# EAGLE schematic ArduCuff (EAGLE 6.0)
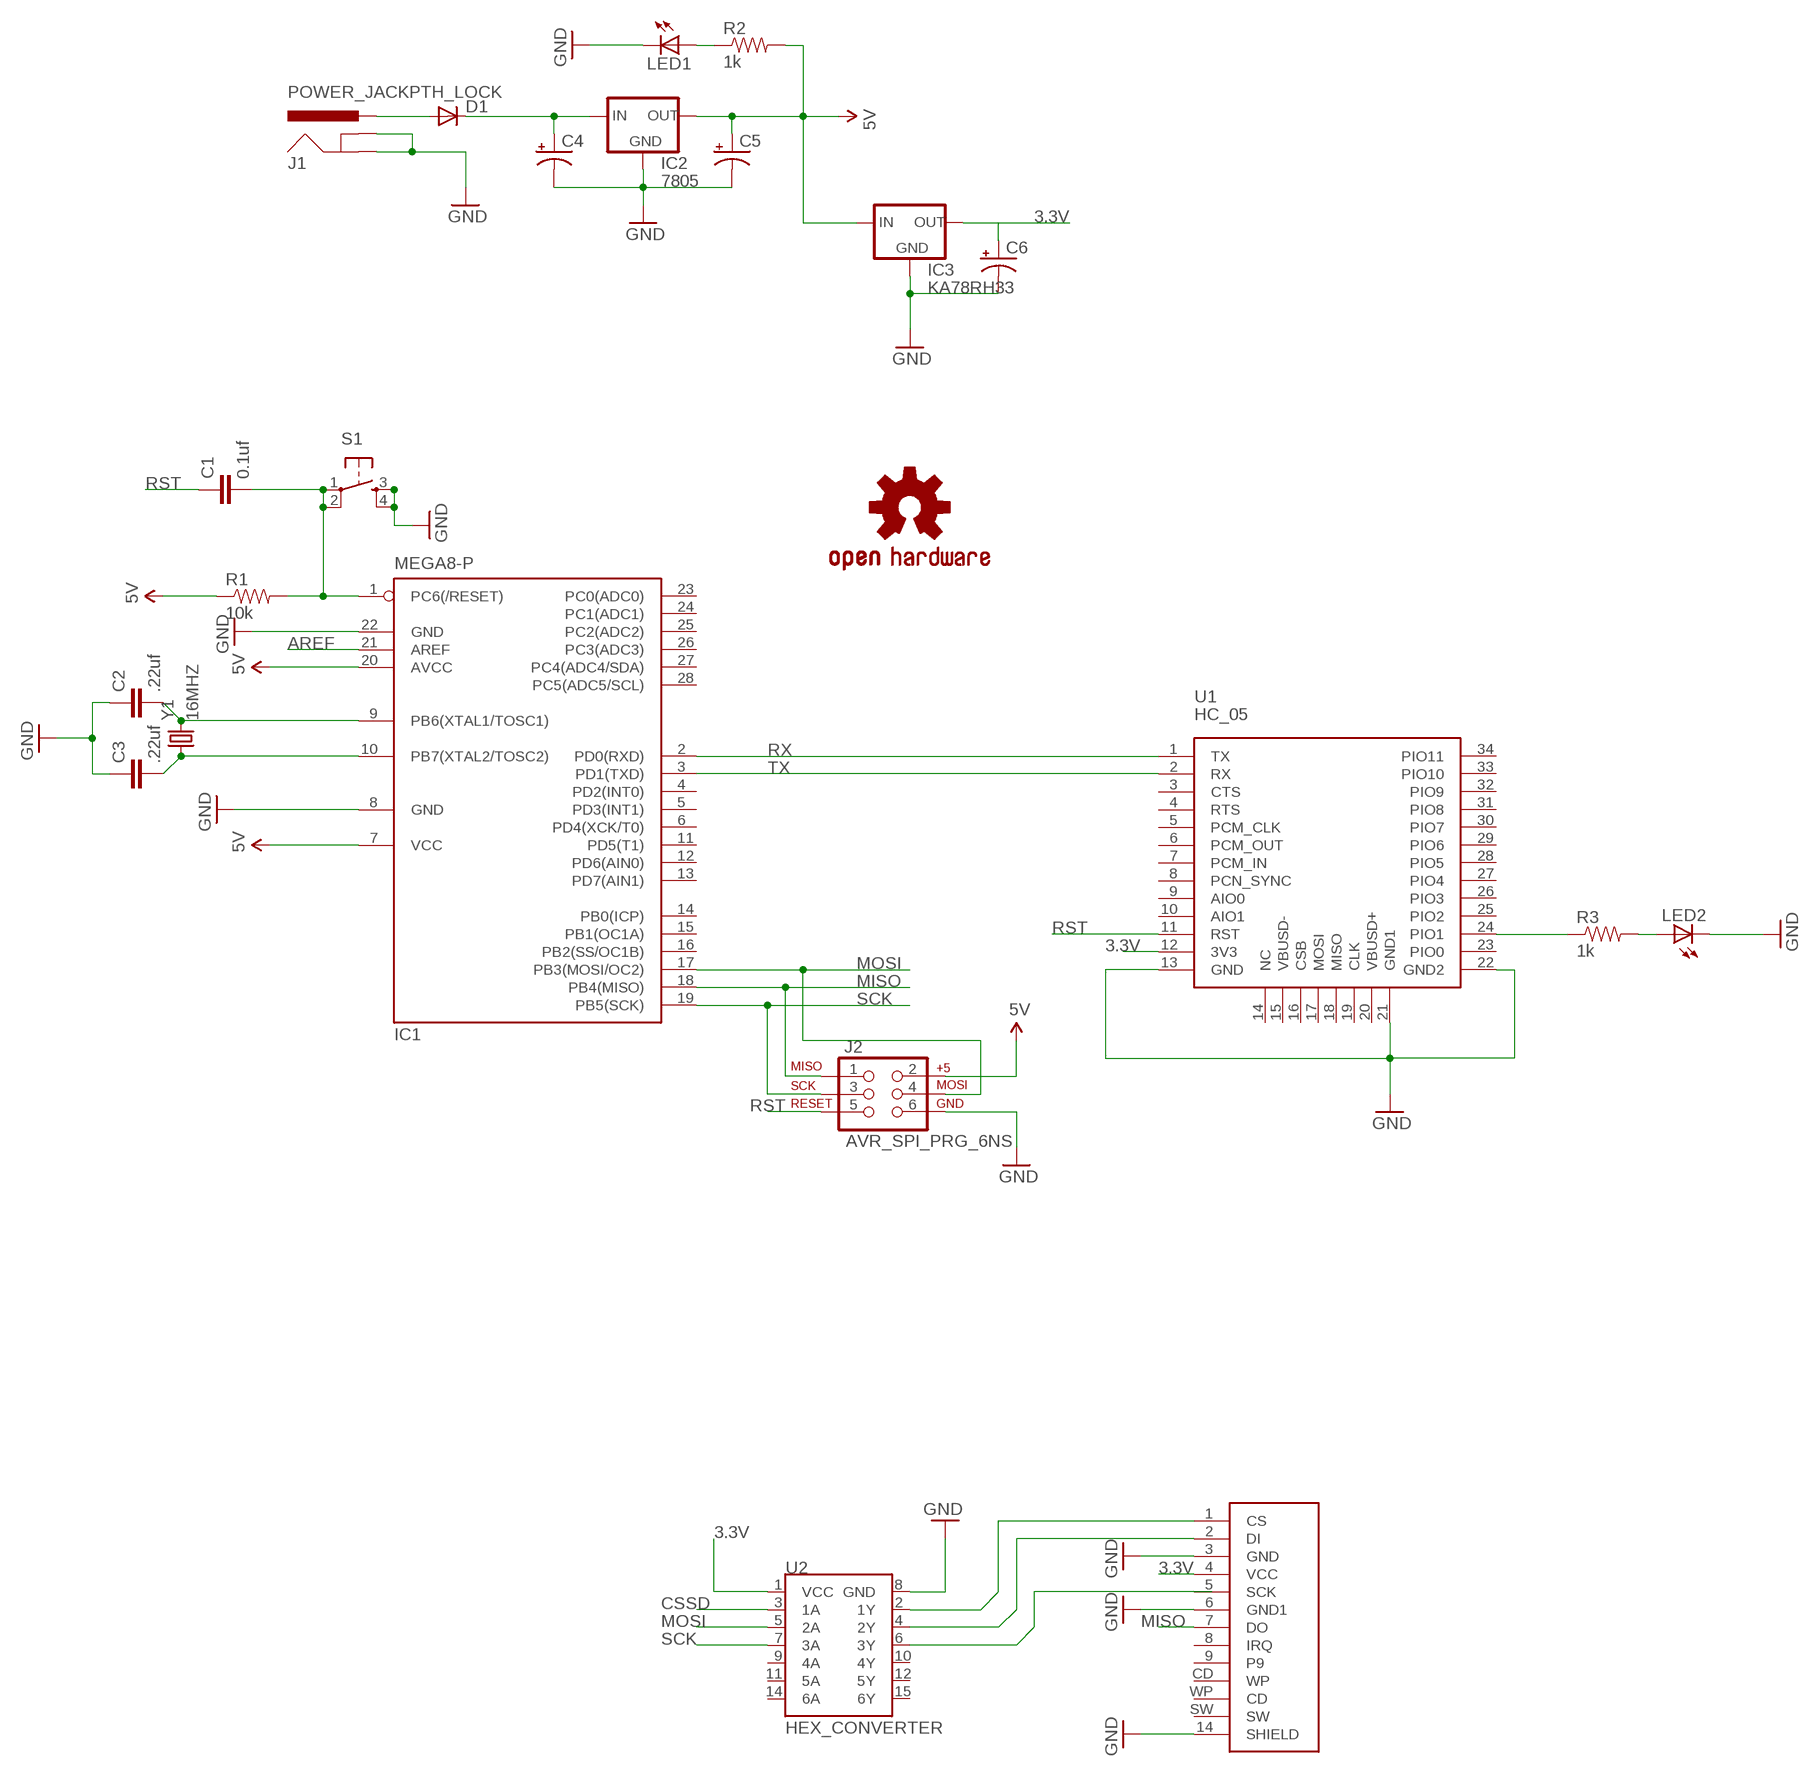
[diagram p0: schematic, sheet 1]

## Parts
C1  0.1uf  CAP1206  [1206]
C2  .22uf  CAP1206  [1206]
C3  .22uf  CAP1206  [1206]
C4  CAP_POLPTH1  [CPOL-RADIAL-100UF-25V]
C5  CAP_POLPTH1  [CPOL-RADIAL-100UF-25V]
C6  CAP_POLPTH1  [CPOL-RADIAL-100UF-25V]
D1  DIODEPTH  [DIODE-1N4001]
IC1  MEGA8-P  [DIL28-3]
IC2  7805  78XXS  [78XXS]
IC3  KA78RH33  78XXS  [78XXS]
J1  POWER_JACKPTH_LOCK  [POWER_JACK_PTH_LOCK]
J2  AVR_SPI_PRG_6NS  [2X3-NS]
LED1  LED3MM  [LED3MM]
LED2  LED3MM  [LED3MM]
R1  10k  RESISTOR1206  [1206]
R2  1k  RESISTOR1206  [1206]
R3  1k  RESISTOR1206  [1206]
S1  TAC_SWITCHPTH  [TACTILE-PTH]
U1  HC_05  [BLUETOOTH_SMD]
U2  HEX_CONVERTER  [SO016]
U$2  SD_CARD_SOCKETSD  [SD-MMC_SOCKET-PP]
U$3  OSHW-LOGOM  [OSHW-LOGO-M]
Y1  16MHZ  CRYSTALHC49US  [HC49US]

## Nets
3.3V: C6.1(+) IC3.OUT U1.12(3V3) U2.1(VCC) U$2.4(VCC)
5V: C5.1(+) IC1.7(VCC) IC1.20(AVCC) IC2.OUT IC3.IN J2.2 R1.1 R2.2
AREF: IC1.21(AREF)
CSSD: U2.3(1A)
GND: C2.1 C3.1 C4.2(-) C5.2(-) C6.2(-) IC1.8(GND) IC1.22(GND) IC2.GND IC3.GND J1.GND J1.GNDBREAK J2.6 LED1.K(C) LED2.K(C) S1.3 S1.4 U1.13(GND) U1.21(GND1) U1.22(GND2) U2.8(GND) U$2.3(GND) U$2.6(GND1) U$2.14(SHIELD)
MISO: IC1.18(PB4(MISO)) J2.1 U$2.7(DO)
MOSI: IC1.17(PB3(MOSI/OC2)) J2.4 U2.5(2A)
N$1: C1.2 IC1.1(PC6(/RESET)) R1.2 S1.1 S1.2
N$2: C2.2 IC1.9(PB6(XTAL1/TOSC1)) Y1.2
N$3: C3.2 IC1.10(PB7(XTAL2/TOSC2)) Y1.1
N$4: R3.1 U1.24(PIO1)
N$5: D1.A J1.PWR
N$6: C4.1(+) D1.C IC2.IN
N$7: LED2.A R3.2
N$8: U2.2(1Y) U$2.1(CS)
N$9: LED1.A R2.1
N$10: U2.4(2Y) U$2.2(DI)
N$11: U2.6(3Y)
RST: C1.1 J2.5 U1.11(RST)
RX: IC1.2(PD0(RXD)) U1.1(TX)
SCK: IC1.19(PB5(SCK)) J2.3 U2.7(3A)
TX: IC1.3(PD1(TXD)) U1.2(RX)
Unconnected: IC1.4(PD2(INT0)) IC1.5(PD3(INT1)) IC1.6(PD4(XCK/T0)) IC1.11(PD5(T1)) IC1.12(PD6(AIN0)) IC1.13(PD7(AIN1)) IC1.14(PB0(ICP)) IC1.15(PB1(OC1A)) IC1.16(PB2(SS/OC1B)) IC1.23(PC0(ADC0)) IC1.24(PC1(ADC1)) IC1.25(PC2(ADC2)) IC1.26(PC3(ADC3)) IC1.27(PC4(ADC4/SDA)) IC1.28(PC5(ADC5/SCL)) U1.3(CTS) U1.4(RTS) U1.5(PCM_CLK) U1.6(PCM_OUT) U1.7(PCM_IN) U1.8(PCN_SYNC) U1.9(AIO0) U1.10(AIO1) U1.14(NC) U1.15(VBUSD-) U1.16(CSB) U1.17(MOSI) U1.18(MISO) U1.19(CLK) U1.20(VBUSD+) U1.23(PIO0) U1.25(PIO2) U1.26(PIO3) U1.27(PIO4) U1.28(PIO5) U1.29(PIO6) U1.30(PIO7) U1.31(PIO8) U1.32(PIO9) U1.33(PIO10) U1.34(PIO11) U2.9(4A) U2.10(4Y) U2.11(5A) U2.12(5Y) U2.14(6A) U2.15(6Y) U$2.5(SCK) U$2.8(IRQ) U$2.9 U$2.CD(WP) U$2.SW U$2.WP(CD)

## Library data of the parts
C1-C3 = SparkFun:CAP: Capacitor Standard 0603 ceramic capacitor, and 0.1" leaded capacitor.
C4-C6 = SparkFun:CAP_POL: Capacitor Polarized These are standard SMD and PTH capacitors. Normally 10uF, 47uF, and 100uF in electrolytic and tantalum varieties. Always verify the external diameter of the through hole cap, it varies with capacity, voltage, and manufacturer. The EIA devices should be standard.
D1 = SparkFun:DIODE: Diode These are standard reverse protection diodes and small signal diodes. SMA package can handle up to about 1A. SOD-323 can handle about 200mA. What the SOD-323 package when ordering, there are some mfgs out there that are 5-pin packages.
IC1 = atmel:MEGA8-P: MICROCONTROLLER 8 Kbytes FLASH, 1 kbytes SRAM, 512 bytes EEPROM, USART, 4-channel 10 bit ADC, 2-channel 8 bit ADC Pin compatible with Atmega48, ATMega88, ATMega168 Source: avr.lbr; OC_FARNELL: unknown; OC_NEWARK: unknown
IC2 IC3 = v-reg:78XXS: VOLTAGE REGULATOR
J1 = SparkFun:POWER_JACK: Power Jack This is the standard 5.5mm barrel jack for power. The PTH is the most common, proven, reliable, footprint. All others are experimental. The Slot footprint only works if the mill layer is transmitted to the PCB fab house so be warned. Spark Fun Electronics SKU : PRT-00119. Mating wall wart : TOL-00298 (and others)
J2 = SparkFun:AVR_SPI_PRG_6: AVR ISP 6 Pin This is the reduced ISP connector for AVR programming. Common on Arduino. This footprint will take up less PCB space and can be used with a 10-pin to 6-pin adapter such as SKU: BOB-08508
LED1 LED2 = SparkFun:LED: LEDs Standard schematic elements and footprints for 5mm, 3mm, 1206, and 0603 sized LEDs. 5mm - Spark Fun Electronics SKU : COM-00529 (and others)
R1-R3 = SparkFun:RESISTOR: Resistor Basic schematic elements and footprints for 0603, 1206, and PTH resistors.
S1 = SparkFun:TAC_SWITCH: Momentary Switch Button commonly used for reset or general input. Spark Fun Electronics SKU : COM-00097
U1 = SerialPortBluetooth:HC_05
U2 = SparkFun:HEX_CONVERTER
U$2 = SparkFun:SD_CARD_SOCKET: SD/MMC Socket Media socket for SD and MMC cards. Push-push type. Schematic element and footprint production proven. Spark Fun Electronics SKU : PRT-00136
U$3 = SparkFun:OSHW-LOGO: Open Source Hardware Logo This logo indicates the piece of hardware it is found on incorporates a OSHW license and/or adheres to the definition of open source hardware found here: http://freedomdefined.org/OSHW
Y1 = SparkFun:CRYSTAL: Crystals Various standard crystals. Proven footprints. Spark Fun Electronics SKU : COM-00534